# Altium schematic sheet CAN_Interface.SchDoc: CAN Bus Interface Logic
size B; Engineer: Daisy Chain; DocumentNumber: 3; Revision: 2.3; SheetNumber: 3; SheetTotal: 5
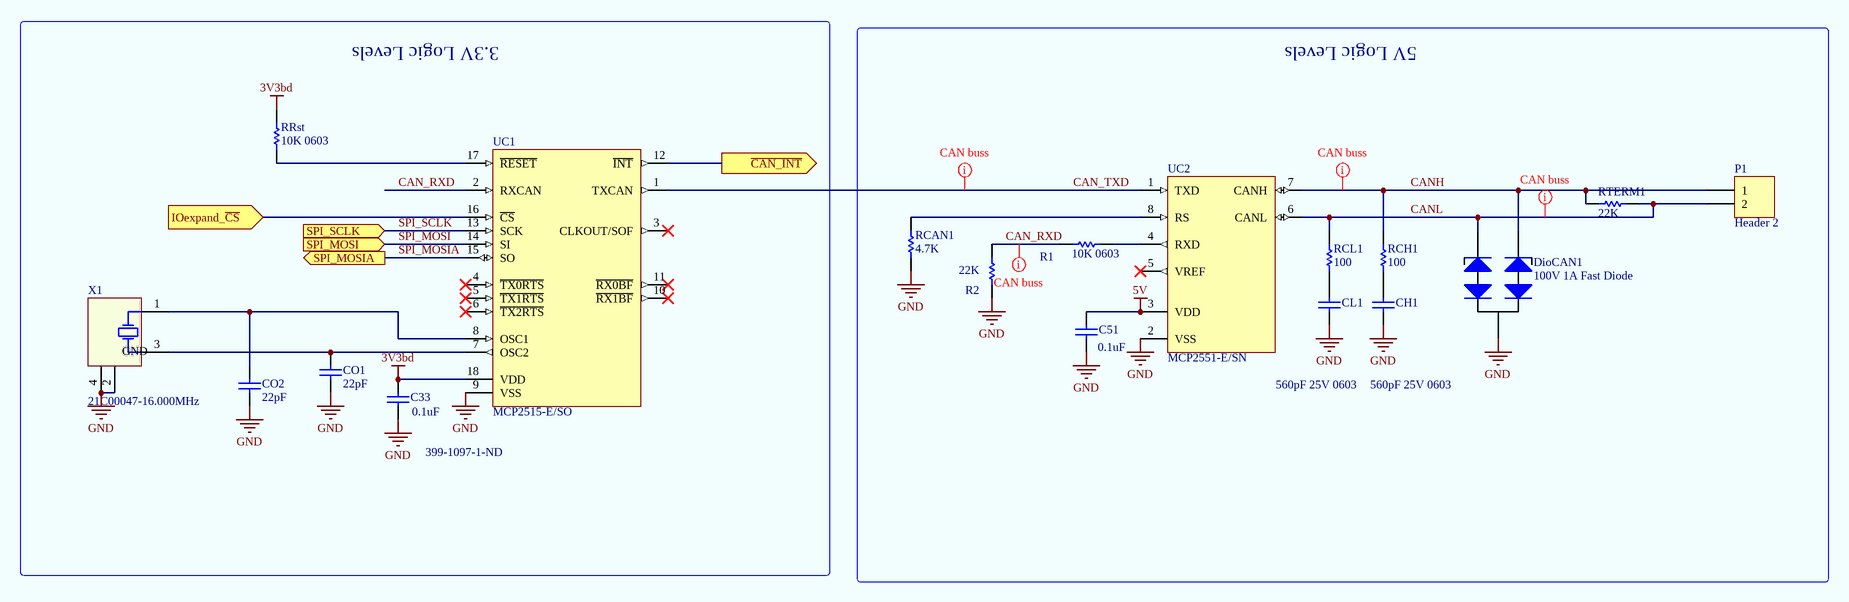
[diagram p0: CAN_Interface.SchDoc]

## Parts
C33  0.1uF  Supplier Part Number 1: 399-1097-1-ND  [0603C_L]
C51  0.1uF  [0603C_L]
CH1  560pF 25V 0603  [0603C_L]
CL1  560pF 25V 0603  [0603C_L]
CO1  22pF  [0603C_L]
CO2  22pF  [0603C_L]
DioCAN1  100V 1A Fast Diode  [SOT23]
P1  Header 2  [HDR1X2]
R1  10K 0603  [0603_L]
R2  22K  [0603_L]
RCAN1  4.7K  [0603_L]
RCH1  100  [0603_L]
RCL1  100  [0603_L]
RRst  10K 0603  [0603_L]
RTERM1  22K  [0603_L]
UC1  MCP2515-E/SO  [SOIC-SO18_M]
UC2  MCP2551-E/SN  [SOIC-SN8_N]
X1  21C00047-16.000MHz  [ITTI-21C00047-16.000MHz-4_V]

## Blocks framed on the sheet
3.3V Logic Levels: C33 CO1 CO2 RRst UC1 X1
5V Logic Levels: C51 CH1 CL1 DioCAN1 P1 R1 R2 RCAN1 RCH1 RCL1 RTERM1 UC2

## Ports
IOexpand_~{CS} (in), SPI_MOSI (in), SPI_MOSIA (out), SPI_SCLK (in), ~{CAN_INT} (out)

## Nets
3V3bd: C33.2 RRst.2 UC1.18(VDD)
5V: C51.2 UC2.3(VDD)
GND: C33.1 C51.1 CH1.2 CL1.1 CO1.1 CO2.2 DioCAN1.3 R2.1 RCAN1.1 UC1.9(VSS) UC2.2(VSS) X1.2(GND) X1.4(GND)
~{CAN_INT}: UC1.12(~{INT}) ; port ~{CAN_INT}
CAN_RXD: R1.2 R2.2 UC1.2(RXCAN)
CAN_TXD: UC1.1(TXCAN) UC2.1(TXD)
CANH: DioCAN1.1(A) P1.1 RCH1.2 RTERM1.2 UC2.7(CANH)
CANL: DioCAN1.2(K) P1.2 RCL1.2 RTERM1.1 UC2.6(CANL)
IOexpand_~{CS}: UC1.16(~{CS}) ; port IOexpand_~{CS}
SPI_MOSI: UC1.14(SI) ; port SPI_MOSI
SPI_MOSIA: UC1.15(SO) ; port SPI_MOSIA
SPI_SCLK: UC1.13(SCK) ; port SPI_SCLK
NetCH1_1: CH1.1 RCH1.1
NetCL1_2: CL1.2 RCL1.1
NetCO1_2: CO1.2 UC1.7(OSC2) X1.3(XTAL)
NetCO2_1: CO2.1 UC1.8(OSC1) X1.1(XTAL)
NetR1_1: R1.1 UC2.4(RXD)
NetRCAN1_2: RCAN1.2 UC2.8(RS)
NetRRst_1: RRst.1 UC1.17(~{RESET})

Not connected (* = marked no-connect by the designer): UC1 3(CLKOUT/SOF)* 4(~{TX0RTS})* 5(~{TX1RTS})* 6(~{TX2RTS})* 10(~{RX1BF})* 11(~{RX0BF})*; UC2 5(VREF)*

## Layout directives
net class CAN; rule Width Constraint [Pref Width = 20mil    Min Width = 10mil    Max Width = 30mil]; rule Clearance Constraint [Clearance = 20mil]: CAN_RXD, CAN_TXD, CANH, CANL

## Notes on the sheet
- Title
- Size:
- Date:
- B
- Project:
- Time:
- Revision:
- Sheet
- of
- Engineer:
- File:

## Library data of the parts
C33 = Cap10uF_25V_0603: Manufacturer: Kemet; Manufacturer Part Number: C0603C104J4RACTU; Capacitance: 100nF; Tolerance: 5%; Voltage Rating: 16V; Type (Capacitors): X7R; Supplier 1: Digikey; Stock 1: 1096346; Pricing 1: 1=0.11, 10=0.078, 25=0.0572, 50=0.0446, 100=0.0369, 250=0.0305, 500=0.0259, 1000=0.0214 (USD); Mount: Surface Mount; Case/Package: 0603; Pins: 2; Case Code (Metric): 1608; Case Code (Imperial): 0603; Min Operating Temperature: -55°C; Max Operating Temperature: 125°C; Package Quantity: 4000; Packaging: Tape and Reel; Voltage Rating (DC): 16V; Length: 1.6mm; Height: 0.8mm; Width: 0.8mm; Radiation Hardening: No; REACH SVHC: No SVHC; ComponentLink1URL: https://datasheet.ciiva.com/14589/70095383-14589531.pdf; ComponentLink1Description: https://datasheet.ciiva.com/14589/70095383-14589531.pdf; ComponentLink2URL: https://datasheet.ciiva.com/28645/1851736-28645613.pdf; ComponentLink2Description: https://datasheet.ciiva.com/28645/1851736-28645613.pdf; ComponentLink3URL: https://datasheet.ciiva.com/5999/1732731-5999390.pdf; ComponentLink3Description: https://datasheet.ciiva.com/5999/1732731-5999390.pdf; ComponentLink4URL: https://datasheet.ciiva.com/7823/kem-c1002-x7r-smd-7823982.pdf; ComponentLink4Description: https://datasheet.ciiva.com/7823/kem-c1002-x7r-smd-7823982.pdf
C51 = Cap10uF_25V_0603
CH1 CL1 = Cap560pF_25V_0603: Manufacturer: Taiyo Yuden; Manufacturer Part Number: TMK316F106ZL-T; Catalog Drawings: xMK Series_1206_1.6; Capacitance: 10µF; Tolerance: -20%, +80%; Temperature Coefficient: Y5V (F); Online Catalog: M Series; Other Names: 587-1353-6; Supplier 1: Ciiva; Stock 1: 330483; Pricing 1: 1=0.34, 10=0.255, 50=0.1488, 100=0.119, 250=0.085, 500=0.0578, 1000=0.0468 (USD); Standard Package: 1; Category: Capacitors; Family: Ceramic Capacitors; Series: M; Packaging: Digi-Reel®; Voltage - Rated: 25V; Mounting Type: Surface Mount, MLCC; Operating Temperature: -30°C ~ 85°C; Applications: General Purpose; Ratings: -; Package / Case: 1206 (3216 Metric); Size / Dimension: 0.126" L x 0.063" W (3.20mm x 1.60mm); Height - Seated (Max): -; Thickness (Max): 0.071" (1.80mm); Lead Spacing: -; Features: -; Lead Style: -; ComponentLink1URL: https://datasheet.ciiva.com/30217/73tmk316f106zl-t-30217817.pdf; ComponentLink1Description: https://datasheet.ciiva.com/30217/73tmk316f106zl-t-30217817.pdf; ComponentLink2URL: https://datasheet.ciiva.com/11596/tmk316f106zl-t-ss-11596490.pdf; ComponentLink2Description: https://datasheet.ciiva.com/11596/tmk316f106zl-t-ss-11596490.pdf; ComponentLink3URL: https://datasheet.ciiva.com/137/tmk316f106zl-t-ss-137061.pdf; ComponentLink3Description: https://datasheet.ciiva.com/137/tmk316f106zl-t-ss-137061.pdf; ComponentLink4URL: https://datasheet.ciiva.com/15922/1123tmk316f106zl-t-15922467.pdf; ComponentLink4Description: https://datasheet.ciiva.com/15922/1123tmk316f106zl-t-15922467.pdf; ComponentLink5URL: https://datasheet.ciiva.com/7975/746258-7975854.pdf; ComponentLink5Description: https://datasheet.ciiva.com/7975/746258-7975854.pdf; ComponentLink6URL: https://datasheet.ciiva.com/7975/1693457-7975853.pdf; ComponentLink6Description: https://datasheet.ciiva.com/7975/1693457-7975853.pdf; ComponentLink7URL: https://datasheet.ciiva.com/5744/1497285-5744889.pdf; ComponentLink7Description: https://datasheet.ciiva.com/5744/1497285-5744889.pdf; Supplier Part Number 1: 587-1353-1-ND
CO1 = Cap22pF_50V_0603: Manufacturer: Murata; Manufacturer Part Number: GRM1885C1H220JA01D; Capacitance: 22; Voltage Rating: 50; Tolerance: 5; Type (Capacitors): C0G; Supplier 1: Digikey; Supplier Part Number 1: 490-1411-1-ND; Stock 1: 517556; Pricing 1: 1=0.1, 10=0.061, 50=0.0332, 100=0.0281, 250=0.023, 500=0.0196, 1000=0.0153 (USD); Mount: Surface Mount; Case/Package: 0603; Pins: 2; Case Code (Metric): 1608; Case Code (Imperial): 0603; Min Operating Temperature: -55; Max Operating Temperature: 125; Package Quantity: 1; Packaging: Cut Tape; Voltage Rating (DC): 50; Lead Pitch: 4; Length: 1.6; Height: 0.8; Width: 0.8; Radiation Hardening: No; REACH SVHC: No SVHC; ComponentLink1URL: https://datasheet.ciiva.com/131/product-131760.pdf; ComponentLink1Description: https://datasheet.ciiva.com/131/product-131760.pdf; ComponentLink2URL: https://datasheet.ciiva.com/131/partnumbering-e-01-131761.pdf; ComponentLink2Description: https://datasheet.ciiva.com/131/partnumbering-e-01-131761.pdf; ComponentLink3URL: https://datasheet.ciiva.com/14116/grmseries-tc-hitype-eng-14116853.pdf; ComponentLink3Description: https://datasheet.ciiva.com/14116/grmseries-tc-hitype-eng-14116853.pdf; ComponentLink4URL: https://datasheet.ciiva.com/3776/1156grm1885c1h220ja0123-3776984.pdf; ComponentLink4Description: https://datasheet.ciiva.com/3776/1156grm1885c1h220ja0123-3776984.pdf; ComponentLink5URL: https://datasheet.ciiva.com/14116/grmseries-tc-hitype-eng-14116826.pdf; ComponentLink5Description: https://datasheet.ciiva.com/14116/grmseries-tc-hitype-eng-14116826.pdf; ComponentLink6URL: https://datasheet.ciiva.com/11786/0900766b807a1cab-11786398.pdf; ComponentLink6Description: https://datasheet.ciiva.com/11786/0900766b807a1cab-11786398.pdf; ComponentLink7URL: https://datasheet.ciiva.com/131/partnumbering-e-01-131759.pdf; ComponentLink7Description: https://datasheet.ciiva.com/131/partnumbering-e-01-131759.pdf
CO2 = Cap100nF_50V_0603: Manufacturer: Murata; Manufacturer Part Number: GRM1885C1H220JA01D; Capacitance: 22; Voltage Rating: 50; Tolerance: 5; Type (Capacitors): C0G; Supplier 1: Digikey; Supplier Part Number 1: 490-1411-1-ND; Stock 1: 517556; Pricing 1: 1=0.1, 10=0.061, 50=0.0332, 100=0.0281, 250=0.023, 500=0.0196, 1000=0.0153 (USD); Mount: Surface Mount; Case/Package: 0603; Pins: 2; Case Code (Metric): 1608; Case Code (Imperial): 0603; Min Operating Temperature: -55; Max Operating Temperature: 125; Package Quantity: 1; Packaging: Cut Tape; Voltage Rating (DC): 50; Lead Pitch: 4; Length: 1.6; Height: 0.8; Width: 0.8; Radiation Hardening: No; REACH SVHC: No SVHC; ComponentLink1URL: https://datasheet.ciiva.com/131/product-131760.pdf; ComponentLink1Description: https://datasheet.ciiva.com/131/product-131760.pdf; ComponentLink2URL: https://datasheet.ciiva.com/131/partnumbering-e-01-131761.pdf; ComponentLink2Description: https://datasheet.ciiva.com/131/partnumbering-e-01-131761.pdf; ComponentLink3URL: https://datasheet.ciiva.com/14116/grmseries-tc-hitype-eng-14116853.pdf; ComponentLink3Description: https://datasheet.ciiva.com/14116/grmseries-tc-hitype-eng-14116853.pdf; ComponentLink4URL: https://datasheet.ciiva.com/3776/1156grm1885c1h220ja0123-3776984.pdf; ComponentLink4Description: https://datasheet.ciiva.com/3776/1156grm1885c1h220ja0123-3776984.pdf; ComponentLink5URL: https://datasheet.ciiva.com/14116/grmseries-tc-hitype-eng-14116826.pdf; ComponentLink5Description: https://datasheet.ciiva.com/14116/grmseries-tc-hitype-eng-14116826.pdf; ComponentLink6URL: https://datasheet.ciiva.com/11786/0900766b807a1cab-11786398.pdf; ComponentLink6Description: https://datasheet.ciiva.com/11786/0900766b807a1cab-11786398.pdf; ComponentLink7URL: https://datasheet.ciiva.com/131/partnumbering-e-01-131759.pdf; ComponentLink7Description: https://datasheet.ciiva.com/131/partnumbering-e-01-131759.pdf
DioCAN1 = PESD1CAN: High Conductance Fast Diode; Manufacturer: ON Semiconductor; Manufacturer Part Number: MUR110RLG; Diode Case Style: DO-204AL; Diode Configuration: Single; Diode Type: Fast Recovery; Forward Surge Current Ifsm Max: 35A; Forward Voltage VF Max: 1.25V; No. of Pins: 2; Reverse Recovery Time trr Max: 75ns; SVHC: No SVHC (16-Jun-2014); Supplier 1: Ciiva; Supplier Part Number 1: MUR110RLGOSCT-ND; Stock 1: 22453; Pricing 1: 1=0.48, 10=0.362, 100=0.2254, 500=0.1541, 1000=0.1185 (USD); Forward Current If(AV): 1A; Operating Temperature Max: 175°C; Packaging: Each; Repetitive Reverse Voltage Vrrm Max: 100V; ComponentLink1URL: https://datasheet.ciiva.com/915/mur120-d-915616.pdf; ComponentLink1Description: https://datasheet.ciiva.com/915/mur120-d-915616.pdf; ComponentLink2URL: https://datasheet.ciiva.com/30479/0900766b812212ee-30479481.pdf; ComponentLink2Description: https://datasheet.ciiva.com/30479/0900766b812212ee-30479481.pdf; ComponentLink3URL: https://datasheet.ciiva.com/25950/mur120-d-25950702.pdf; ComponentLink3Description: https://datasheet.ciiva.com/25950/mur120-d-25950702.pdf; ComponentLink4URL: https://datasheet.ciiva.com/16474/mur120-d-16474333.pdf; ComponentLink4Description: https://datasheet.ciiva.com/16474/mur120-d-16474333.pdf; ComponentLink5URL: https://datasheet.ciiva.com/915/mur120-d-915618.pdf; ComponentLink5Description: https://datasheet.ciiva.com/915/mur120-d-915618.pdf; ComponentLink6URL: https://datasheet.ciiva.com/915/mur120-d-915619.pdf; ComponentLink6Description: https://datasheet.ciiva.com/915/mur120-d-915619.pdf; ComponentLink7URL: https://datasheet.ciiva.com/16208/mur120-d-16208137.pdf; ComponentLink7Description: https://datasheet.ciiva.com/16208/mur120-d-16208137.pdf
P1 = Header 2: Header, 2-Pin; LatestRevisionDate: 17-Jul-2002; LatestRevisionNote: Re-released for DXP Platform.; Publisher: Altium Limited
R1 = Res4K99_0603: Manufacturer: Yageo; Manufacturer Part Number: RT0603DRD074K99L; Tolerance: ±0.5%; Power (Watts): 0.1W, 1/10W; Temperature Coefficient: ±25ppm/°C; Supplier 1: Digi-Key; RoHS: RoHS Compliant; Category: Resistors; Stock 1: 28874; Pricing 1: 1=0.22, 10=0.184, 25=0.134, 100=0.0721, 250=0.05532, 500=0.04358, 1000=0.03018, 2500=0.02766 (USD); Packaging: Cut Tape (CT); Part Status: Active; Resistance (Ohms): 10K; Composition: Thin Film; Features: Moisture Resistant; Operating Temperature: -55°C ~ 155°C; Package / Case: 0603 (1608 Metric); Supplier Device Package: 0603; Size / Dimension: 0.063" L x 0.031" W (1.60mm x 0.80mm); Height: 0.022" (0.55mm); Number of Terminations: 2; Failure Rate: -; ComponentLink1URL: http://www.yageo.com/documents/recent/PYu-RT_1-to-0.05_RoHS_L_6.pdf; ComponentLink1Description: http://www.yageo.com/documents/recent/PYu-RT_1-to-0.05_RoHS_L_6.pdf; Supplier Part Number 1: 311-10KDCT-ND
R2 RTERM1 = Res_0603: Manufacturer: Yageo; Manufacturer Part Number: RT0603DRD0722KL; Resistance: 22 kOhms; Tolerance: 0.5 %; Power Rating: 100 mW; Temperature Coefficient: 25 PPM / C; Voltage Rating: 75 V; Unit Weight: 0.000071 oz; Supplier 1: Digikey; Supplier Part Number 1: 311-22KDDKR-ND; Stock 1: 39729; Pricing 1: 1=0.12, 10=0.104, 25=0.0716, 50=0.0558, 100=0.0399, 250=0.0311, 500=0.0247, 1000=0.0175 (USD); Product Category: Thin Film Resistors - SMD; RoHS: True; Case Code - in: 0603; Case Code - mm: 1608; Operating Temperature Range: - 55 C to + 125 C; Series: RT; Packaging: Reel; Brand: Yageo; Height: 0.45 mm; Length: 1.6 mm; Package / Case: 0603 (1608 metric); Product: Thin Film Resistors SMD; Termination Style: SMD/SMT; Type: High Precision, High Stability; Width: 0.8 mm; ComponentLink1URL: https://datasheet.ciiva.com/12810/pyu-rt-1-to-0-05-rohs-l-4-12810773.pdf; ComponentLink1Description: https://datasheet.ciiva.com/12810/pyu-rt-1-to-0-05-rohs-l-4-12810773.pdf
RCAN1 = Res4K99_0603: Manufacturer: Yageo; Manufacturer Part Number: RT0603DRD074K99L; Resistance (Ohms): 4.99k; Tolerance: ±0.5%; Power (Watts): 0.1W, 1/10W; Temperature Coefficient: ±25ppm/°C; Supplier 1: Digi-Key; RoHS: RoHS Compliant; Category: Resistors; Stock 1: 28874; Pricing 1: 1=0.22, 10=0.184, 25=0.134, 100=0.0721, 250=0.05532, 500=0.04358, 1000=0.03018, 2500=0.02766 (USD); Packaging: Cut Tape (CT); Part Status: Active; Composition: Thin Film; Features: Moisture Resistant; Operating Temperature: -55°C ~ 155°C; Package / Case: 0603 (1608 Metric); Supplier Device Package: 0603; Size / Dimension: 0.063" L x 0.031" W (1.60mm x 0.80mm); Height: 0.022" (0.55mm); Number of Terminations: 2; Failure Rate: -; ComponentLink1URL: http://www.yageo.com/documents/recent/PYu-RT_1-to-0.05_RoHS_L_6.pdf; ComponentLink1Description: http://www.yageo.com/documents/recent/PYu-RT_1-to-0.05_RoHS_L_6.pdf; Supplier Part Number 1: 311-4.99KDCT-ND
RCH1 RCL1 = Res330_0603: Manufacturer: Yageo; Manufacturer Part Number: RC0603JR-07330RL; Resistance (Ohms): 330; Tolerance: ±5%; Power (Watts): 0.1W, 1/10W; Temperature Coefficient: ±100ppm/°C; Supplier 1: Digi-Key; RoHS: RoHS Compliant; Category: Resistors; Stock 1: 1303594; Pricing 1: 1=0.1, 10=0.011, 25=0.008, 100=0.0044, 250=0.00336, 500=0.0027, 1000=0.00198, 2500=0.00172 (USD); Packaging: Cut Tape (CT); Part Status: Active; Composition: Thick Film; Features: Moisture Resistant; Operating Temperature: -55°C ~ 155°C; Package / Case: 0603 (1608 Metric); Supplier Device Package: 0603; Size / Dimension: 0.063" L x 0.031" W (1.60mm x 0.80mm); Height: 0.022" (0.55mm); Number of Terminations: 2; Failure Rate: -; ComponentLink1URL: http://www.yageo.com/documents/recent/PYu-RC_Group_51_RoHS_L_04.pdf; ComponentLink1Description: http://www.yageo.com/documents/recent/PYu-RC_Group_51_RoHS_L_04.pdf; Supplier Part Number 1: 311-330GRCT-ND
RRst = Res10K_0603: Manufacturer: Panasonic Electronic Components; Manufacturer Part Number: ERJ-3GEYJ102V; Resistance (Ohms): 1k; Tolerance: ±5%; Power (Watts): 0.1W, 1/10W; Temperature Coefficient: ±200ppm/°C; Supplier 1: Digi-Key; RoHS: RoHS Compliant; Category: Resistors; Stock 1: 1335381; Pricing 1: 1=0.1, 50=0.0096, 100=0.0071, 250=0.00544, 500=0.00436, 1000=0.00321 (USD); Packaging: Cut Tape (CT); Part Status: Active; Composition: Thick Film; Features: Automotive AEC-Q200; Operating Temperature: -55°C ~ 155°C; Package / Case: 0603 (1608 Metric); Supplier Device Package: 0603; Size / Dimension: 0.063" L x 0.031" W (1.60mm x 0.80mm); Height: 0.022" (0.55mm); Number of Terminations: 2; Failure Rate: -; ComponentLink1URL: http://industrial.panasonic.com/www-cgi/jvcr13pz.cgi?E+PZ+3+AOA0001+ERJ3GEYJ102V+7+WW; ComponentLink1Description: http://industrial.panasonic.com/www-cgi/jvcr13pz.cgi?E+PZ+3+AOA0001+ERJ3GEYJ102V+7+WW; Supplier Part Number 1: P10KGCT-ND
UC1 = CMP-0186-00035-2: Stand-Alone CAN Controller With SPI Interface, 18-Pin SOIC, Extended Temperature; RevisionNote: URLs added. DatasheetVersion updated.; DatasheetVersion: revF, Oct-2010; ComponentLink2Description: Datasheet; ComponentLink3Description: Package Specification; ComponentLink1Description: Manufacturer URL; PackageReference: SOIC-SO18; PackageDescription: 18-Lead Plastic Small Outline (SO) - Wide 7.50mm Body [SOIC]; PackageVersion: revBB, Aug-2009; ComponentLink1URL: http://www.microchip.com/; ComponentLink3URL: http://www.microchip.com/stellent/groups/techpub_sg/documents/packagingspec/en012702.pdf; ComponentLink2URL: http://ww1.microchip.com/downloads/en/DeviceDoc/21801f.pdf; Code_JEDEC: MS-013
UC2 = CMP-0186-00038-2: High-Speed CAN Transceiver, 8-Pin SOIC, Extended Temperature; PackageReference: SOIC-SN8; Code_JEDEC: MS-012; ComponentLink1Description: Manufacturer URL; ComponentLink1URL: http://www.microchip.com/; PackageVersion: revBB, Aug-2009; ComponentLink3Description: Package Specification; Code_IPC: SOIC127P600-8; ComponentLink2URL: http://ww1.microchip.com/downloads/en/DeviceDoc/21667F.pdf; RevisionNote: URLs added. DatasheetVersion updated.; ComponentLink3URL: http://www.microchip.com/stellent/groups/techpub_sg/documents/packagingspec/en012702.pdf; DatasheetVersion: revF, Jul-2010; ComponentLink2Description: Datasheet; PackageDescription: 8-Lead Plastic Small Outline (SN) - Narrow, 3.90mm Body [SOIC]
X1 = CMP-0464-00001-2: Crystal, 16 MHz, -30 to 85 degC, 3.2 x 2.5 x 0.9 mm SMD; Manufacturer: ITTI; Frequency Tolerance: +/-20 ppm; Load Capacitance: 10 pF; Drive Level: 100 max. uw; Nominal Frequency: 16 MHz; Overtone order: Fundamental; ComponentLink1Description: Manufacturer URL; PackageDescription: 4-Pin Hand Drawn, Body 3.2 x 2.5mm; ComponentLink1URL: http://www.itti-co.com; PartNumber: 21C00047-16.000MHz; Operating temperature: -30 to 85 degC; PackageReference: 21C00047-16.000MHz-4; Mounting Technology: Surface Mount